# EAGLE schematic V-00335-02 (EAGLE 7.2.0)
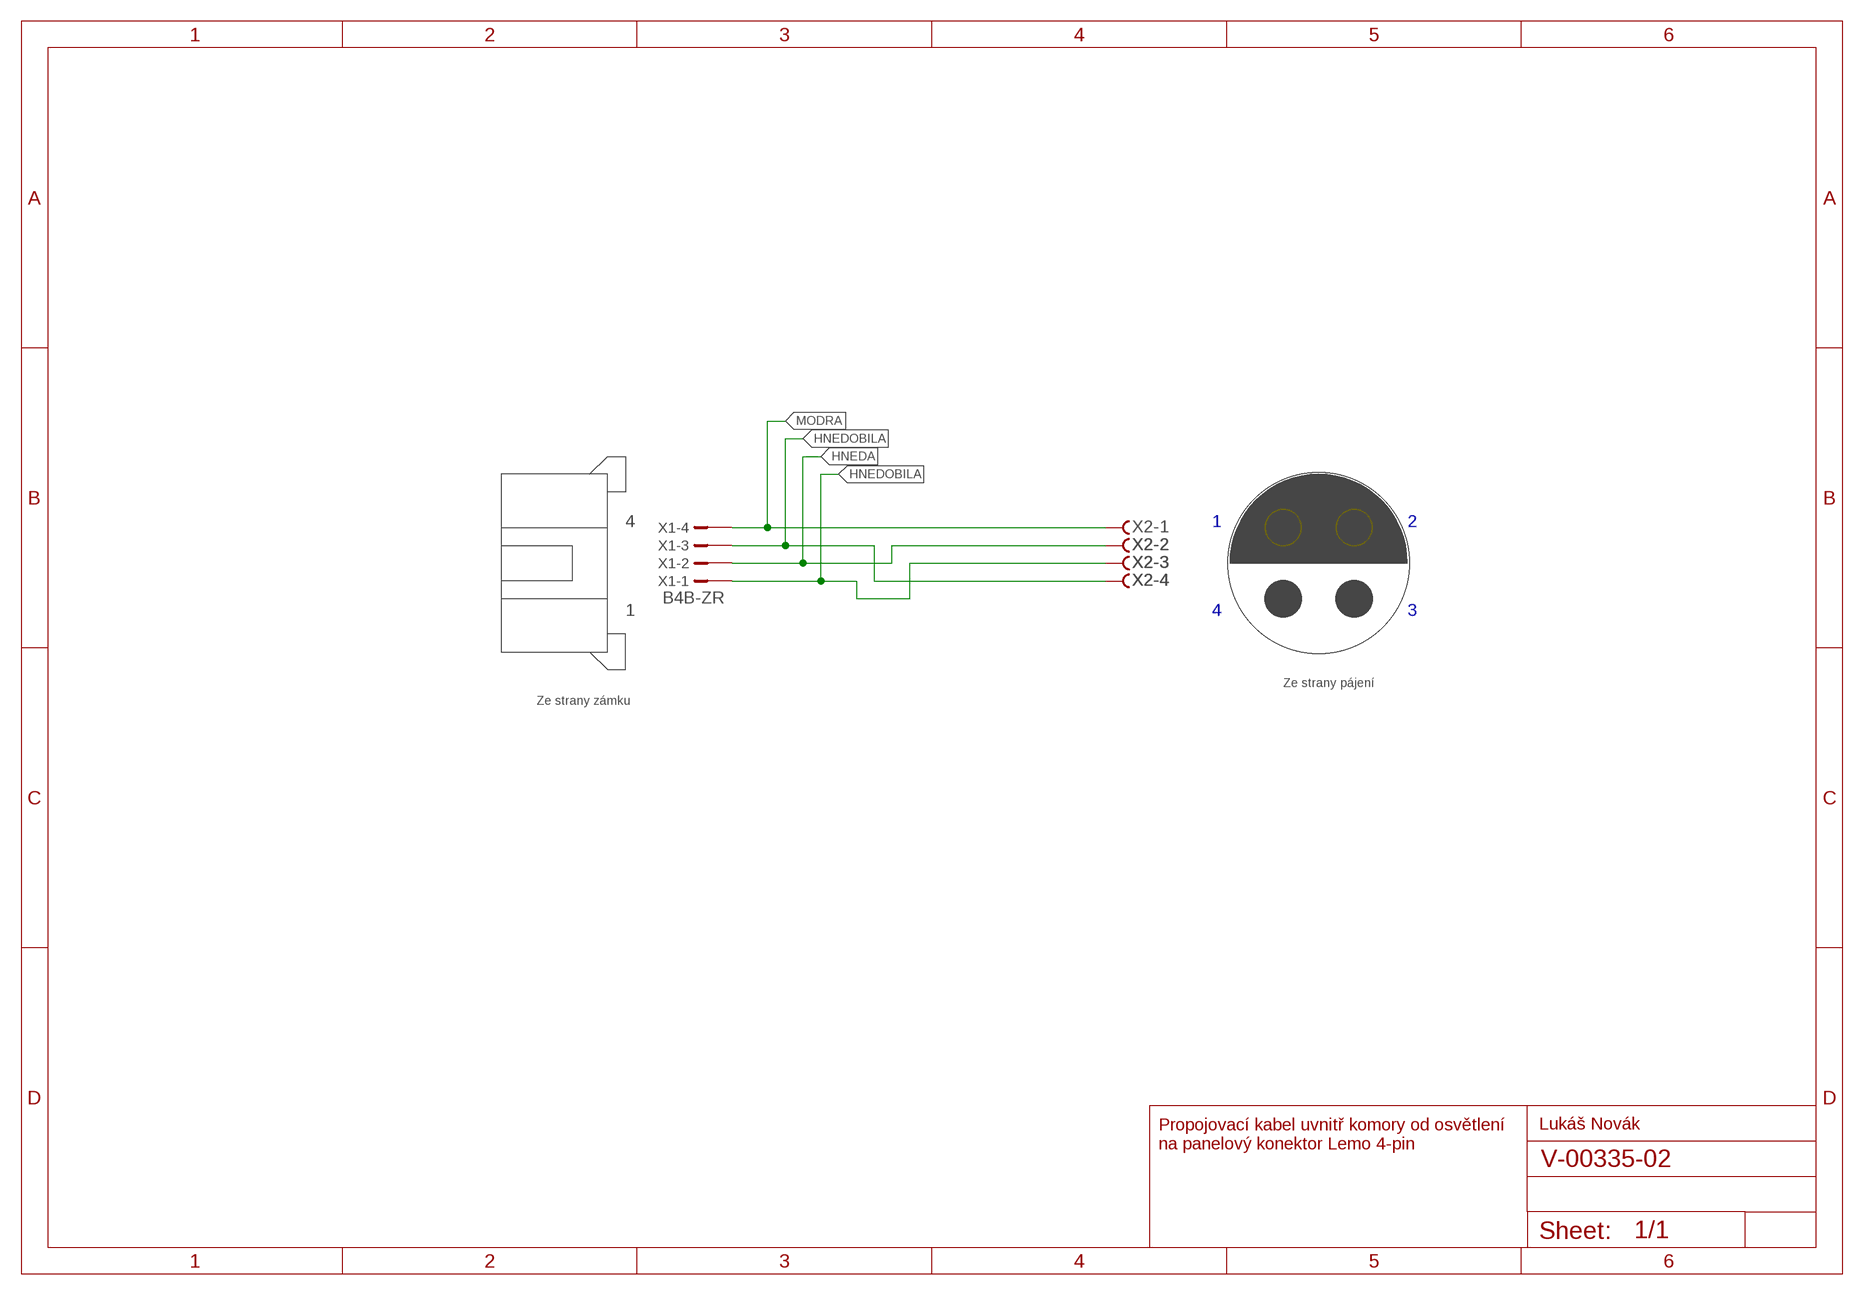
[diagram p0: schematic, sheet 1]

## Parts
X1  B4B-ZR  [B4B-ZR]
X2  LE4MP  [LE4MP]

## Nets
HNEDA: X1.2 X2.2
HNEDOBILA: X1.1 X1.3 X2.3 X2.4
MODRA: X1.4 X2.1

## Notes on the sheet
- 4 | 1 | 2
- 1 | 4 | 3
- Ze strany pájení
- Ze strany zámku
- Lukáš Novák
- Propojovací kabel uvnitř komory od osvětlení
  na panelový konektor Lemo 4-pin

## Library data of the parts
X1 = con-jst:?4B-ZR: ZH CONNECTOR 1.5 mm, 4 pin 1 row Source: http://www.jst.com .. eZH.pdf; MF: FARNELL; MPN: B4B-ZR(LF)(SN); OC_FARNELL: 1830916; OC_NEWARK: 37K9960
X2 = Kabely:LE4MP